# Altium project PCB_Pool.PrjPCB
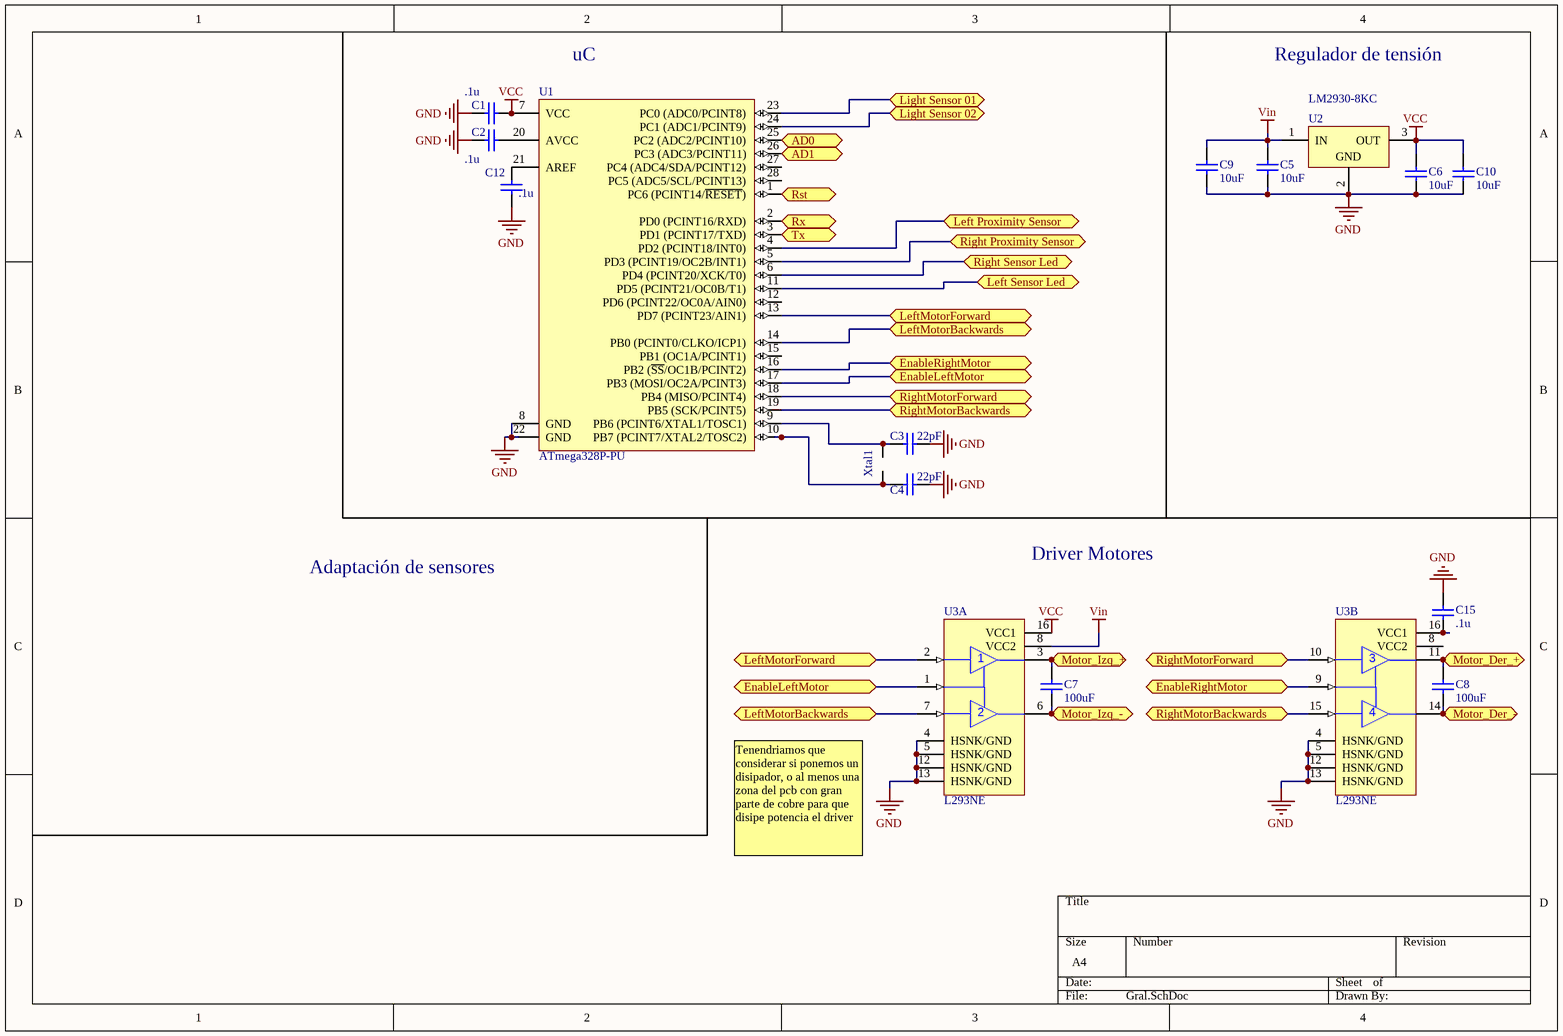
[diagram p0: Gral.SchDoc]
2 sheets, 41 parts. Net scope: flat (ports and power ports of the same name join across sheets).
Board file: Main.PcbDoc
Sheets:
  Gral.SchDoc
  Perifericos.SchDoc

## Sheet Gral.SchDoc
size A4

### Parts
C1  value .1u  [RAD-0.3]  (hidden comment: Cap)
C2  value .1u  [RAD-0.3]  (hidden comment: Cap)
C3  value 22pF  [RAD-0.3]  (hidden comment: Cap)
C4  value 22pF  [RAD-0.3]  (hidden comment: Cap)
C5  value 10uF  [RAD-0.3]  (hidden comment: Cap)
C6  value 10uF  [RAD-0.3]  (hidden comment: Cap)
C7  value 100uF  [RAD-0.3]  (hidden comment: Cap)
C8  value 100uF  [RAD-0.3]  (hidden comment: Cap)
C9  value 10uF  [RAD-0.3]  (hidden comment: Cap)
C10  value 10uF  [RAD-0.3]  (hidden comment: Cap)
C12  value .1u  [RAD-0.3]  (hidden comment: Cap)
C15  value .1u  [RAD-0.3]  (hidden comment: Cap)
U1  ATmega328P-PU  [28P3]
U2  LM2930-8KC  [KC03]
U3  L293NE  [NE016]  (parts A,B of 2)
Xtal1  Xtal  [Xtal]  (value not drawn)

### Ports
AD0, AD1, EnableLeftMotor, EnableRightMotor, Left Proximity Sensor, Left Sensor Led, LeftMotorBackwards, LeftMotorForward, Light Sensor 01, Light Sensor 02, Motor_Der_+, Motor_Der_-, Motor_Izq_+, Motor_Izq_-, Right Proximity Sensor, Right Sensor Led, RightMotorBackwards, RightMotorForward, Rst, Rx, Tx

### Nets
GND: C1.1 C2.1 C3.2 C4.2 C5.1 C6.1 C9.1 C10.1 C12.1 C15.1 U1.8(GND) U1.22(GND) U2.2(GND) U3.4(HSNK/GND) U3.5(HSNK/GND) U3.12(HSNK/GND) U3.13(HSNK/GND)
VCC: C1.2 C6.2 C10.2 U1.7(VCC) U2.3(OUT) U3.16(VCC1)
Vin: C5.2 C9.2 U2.1(IN) U3.8(VCC2)
NetC2_2: C2.2 U1.20(AVCC)
NetC3_1: C3.1 U1.9(PB6_(PCINT6/XTAL1/TOSC1)) Xtal1.2
NetC4_1: C4.1 U1.10(PB7_(PCINT7/XTAL2/TOSC2)) Xtal1.1
NetC7_1: C7.1 U3.6(2Y) ; port Motor_Izq_-
NetC7_2: C7.2 U3.3(1Y) ; port Motor_Izq_+
NetC8_1: C8.1 U3.14(4Y) ; port Motor_Der_-
NetC8_2: C8.2 U3.11(3Y) ; port Motor_Der_+
NetC11_1: U1.1(PC6_(PCINT14/~{RESET})) ; port Rst
NetC12_2: C12.2 U1.21(AREF)
NetC15_2: C15.2 U3.16(VCC1)
NetP8_2: U1.6(PD4_(PCINT20/XCK/T0)) ; port Right Sensor Led
NetP8_3: U1.4(PD2_(PCINT18/INT0)) ; port Left Proximity Sensor
NetP9_2: U1.11(PD5_(PCINT21/OC0B/T1)) ; port Left Sensor Led
NetP9_3: U1.5(PD3_(PCINT19/OC2B/INT1)) ; port Right Proximity Sensor
NetP12_1: U1.2(PD0_(PCINT16/RXD)) ; port Rx
NetP13_1: U1.3(PD1_(PCINT17/TXD)) ; port Tx
NetP15_1: U1.25(PC2_(ADC2/PCINT10)) ; port AD0
NetP15_2: U1.26(PC3_(ADC3/PCINT11)) ; port AD1
NetP16_1: U1.23(PC0_(ADC0/PCINT8)) ; port Light Sensor 01
NetP17_1: U1.24(PC1_(ADC1/PCINT9)) ; port Light Sensor 02
NetU1_13: U1.13(PD7_(PCINT23/AIN1)) U3.2(1A) ; port LeftMotorForward
NetU1_14: U1.14(PB0_(PCINT0/CLKO/ICP1)) U3.7(2A) ; port LeftMotorBackwards
NetU1_16: U1.16(PB2_(~{SS}/OC1B/PCINT2)) U3.9(3,4EN) ; port EnableRightMotor
NetU1_17: U1.17(PB3_(MOSI/OC2A/PCINT3)) U3.1(1,2EN) ; port EnableLeftMotor
NetU1_18: U1.18(PB4_(MISO/PCINT4)) U3.10(3A) ; port RightMotorForward
NetU1_19: U1.19(PB5_(SCK/PCINT5)) U3.15(4A) ; port RightMotorBackwards

Not connected (* = marked no-connect by the designer): U1 12(PD6_(PCINT22/OC0A/AIN0)) 15(PB1_(OC1A/PCINT1)) 27(PC4_(ADC4/SDA/PCINT12)) 28(PC5_(ADC5/SCL/PCINT13))

### Notes on the sheet
- (near U1) uC
- Regulador de tensión
- Adaptación de sensores
- Driver Motores
- Tenendriamos que considerar si ponemos un disipador, o al menos una zona del pcb con gran parte de cobre para que disipe potencia el driver

### Library data of the parts
C1-C10 C12 C15 = Cap: Capacitor; Published: 8-Jun-2000; LatestRevisionDate: 17-Jul-2002; LatestRevisionNote: Re-released for DXP Platform.; PackageReference: RAD-0.3; Publisher: Altium Limited; PackageDescription: Radial Cap, Thru-Hole; 2 Leads; 0.3 in Pin Spacing
U1 = ATmega328P-PU: 8-bit AVR Microcontroller, 32KB Flash, 1KB EEPROM, 2KB SRAM, 28-pin PDIP, Industrial Grade (-40°C to 85°C); Published: 1-Apr-2010; DatasheetVersion: revA, Jan-2010; PackageVersion: revB, Sep-2001; PackageReference: 28P3; Publisher: Altium Limited; PackageDescription: 28-lead (0.300"/7.62mm Wide) Plastic Dual Inline Package (PDIP); Supplier 1: Digi-Key; Supplier Part Number 1: ATMEGA328P-PU-ND; Supplier 2: Farnell; Supplier Part Number 2: 1715487; Supplier 3: Mouser; Supplier Part Number 3: 556-ATMEGA328P-PU; ComponentLink1Description: Manufacturer Link; ComponentLink1URL: http://www.atmel.com/products/avr/default.asp?; ComponentLink2Description: ATmega48A/48PA/88A/88PA/168A/168PA/328/328P Datasheet; ComponentLink2URL: http://www.atmel.com/dyn/resources/prod_documents/8271.pdf; ComponentLink3Description: ATmega48A/48PA/88A/88PA/168A/168PA/328/328P Summary; ComponentLink3URL: http://www.atmel.com/dyn/resources/prod_documents/8271S.pdf; ComponentLink4Description: Atmel.com Home; ComponentLink4URL: http://www.atmel.com
U2 = LM2930-8KC: 3-Terminal Positive Regulator; Note: Pin 2 is electrically connected to tab; Published: 15-Apr-2002; DatasheetVersion: Jun-1988; PackageVersion: Sep-1995; PackageReference: KC03; Publisher: Altium Limited; PackageDescription: TO, Thru-Hole, Vertical, Heatsink Mounted; 3 In-Line Leads; Pitch 2.54 mm; ComponentLink1Description: Manufacturer Link; ComponentLink1URL: http://www.ti.com/
U3 = L293NE: Quadruple Half-H Driver; Published: 15-May-2002; LatestRevisionDate: 29-May-2009; LatestRevisionNote: Component Body Added.; DatasheetVersion: May-1990; PackageVersion: 1991; PackageReference: NE016; Publisher: Altium Limited; PackageDescription: DIP, 16-Pin, Row Spacing 7.62 mm, Pitch 2.54 mm; Code_JEDEC: MS-001-BB; ComponentLink1Description: Manufacturer Link; ComponentLink1URL: http://www.ti.com/; ComponentLink2Description: Datasheet; ComponentLink2URL: http://www-s.ti.com/sc/ds/l293.pdf

## Sheet Perifericos.SchDoc
size A4
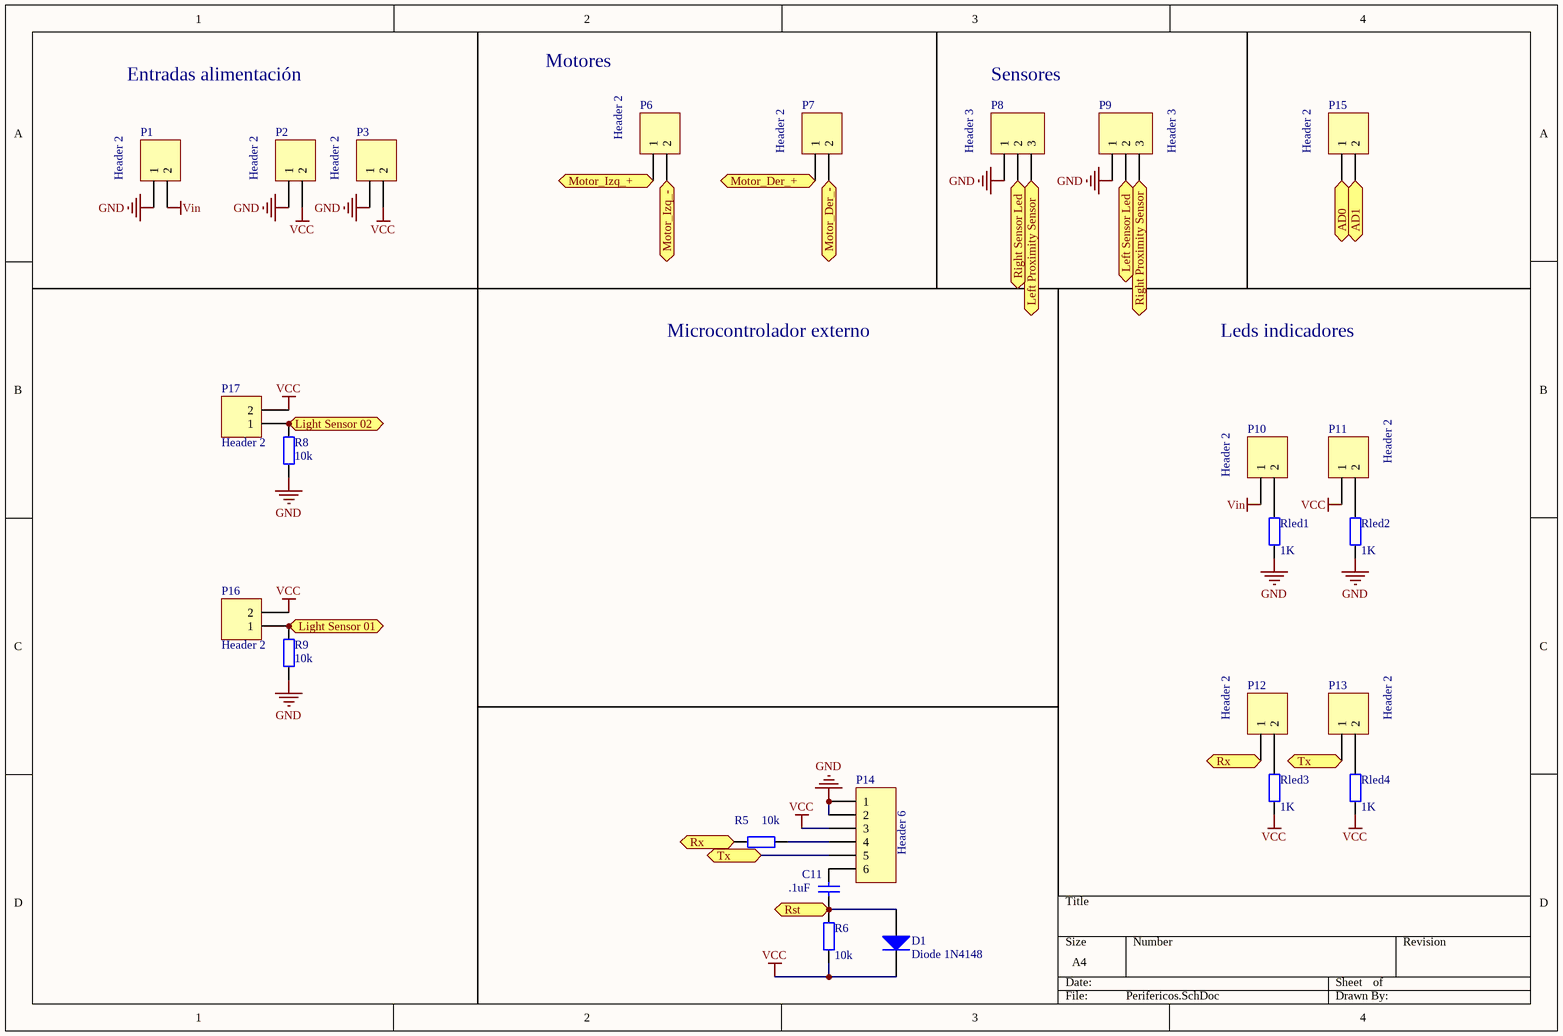
[diagram p1: Perifericos.SchDoc]

### Parts
C11  value .1uF  [RAD-0.3]  (hidden comment: Cap)
D1  Diode 1N4148  [DO-35]
P1  Header 2  [HDR1X2]
P2  Header 2  [HDR1X2]
P3  Header 2  [HDR1X2]
P6  Header 2  [HDR1X2]
P7  Header 2  [HDR1X2]
P8  Header 3  [HDR1X3]
P9  Header 3  [HDR1X3]
P10  Header 2  [HDR1X2]
P11  Header 2  [HDR1X2]
P12  Header 2  [HDR1X2]
P13  Header 2  [HDR1X2]
P14  Header 6  [HDR1X6]
P15  Header 2  [HDR1X2]
P16  Header 2  [HDR1X2]
P17  Header 2  [HDR1X2]
R5  value 10k  [AXIAL-0.4]  (hidden comment: Res2)
R6  value 10k  [AXIAL-0.4]  (hidden comment: Res2)
R8  value 10k  [AXIAL-0.4]  (hidden comment: Res2)
R9  value 10k  [AXIAL-0.4]  (hidden comment: Res2)
Rled1  value 1K  [AXIAL-0.4]  (hidden comment: Res2)
Rled2  value 1K  [AXIAL-0.4]  (hidden comment: Res2)
Rled3  value 1K  [AXIAL-0.4]  (hidden comment: Res2)
Rled4  value 1K  [AXIAL-0.4]  (hidden comment: Res2)

### Ports
AD0, AD1, Left Proximity Sensor, Left Sensor Led, Light Sensor 01, Light Sensor 02, Motor_Der_+, Motor_Der_-, Motor_Izq_+, Motor_Izq_-, Right Proximity Sensor, Right Sensor Led, Rst, Rx, Tx

### Nets
GND: P1.1 P2.1 P3.1 P8.1 P9.1 P14.1 P14.2 R8.1 R9.1 Rled1.1 Rled2.1
VCC: D1.2(K) P2.2 P3.2 P11.1 P14.3 P16.2 P17.2 R6.1 Rled3.1 Rled4.1
Vin: P1.2 P10.1
NetC7_1: P6.2 ; port Motor_Izq_-
NetC7_2: P6.1 ; port Motor_Izq_+
NetC8_1: P7.2 ; port Motor_Der_-
NetC8_2: P7.1 ; port Motor_Der_+
NetC11_1: C11.1 D1.1(A) R6.2 ; port Rst
NetC11_2: C11.2 P14.6
NetP8_2: P8.2 ; port Right Sensor Led
NetP8_3: P8.3 ; port Left Proximity Sensor
NetP9_2: P9.2 ; port Left Sensor Led
NetP9_3: P9.3 ; port Right Proximity Sensor
NetP10_2: P10.2 Rled1.2
NetP11_2: P11.2 Rled2.2
NetP12_1: P12.1 R5.1 ; port Rx
NetP12_2: P12.2 Rled3.2
NetP13_1: P13.1 P14.5 ; port Tx
NetP13_2: P13.2 Rled4.2
NetP14_4: P14.4 R5.2
NetP15_1: P15.1 ; port AD0
NetP15_2: P15.2 ; port AD1
NetP16_1: P16.1 R9.2 ; port Light Sensor 01
NetP17_1: P17.1 R8.2 ; port Light Sensor 02

### Notes on the sheet
- Entradas alimentación
- Motores
- Sensores
- Microcontrolador externo
- Leds indicadores

### Library data of the parts
C11 = Cap: Capacitor; Published: 8-Jun-2000; LatestRevisionDate: 17-Jul-2002; LatestRevisionNote: Re-released for DXP Platform.; PackageReference: RAD-0.3; Publisher: Altium Limited; PackageDescription: Radial Cap, Thru-Hole; 2 Leads; 0.3 in Pin Spacing
D1 = Diode 1N4148: High Conductance Fast Diode; Published: 8-Jun-2000; LatestRevisionDate: 17-Jul-2002; LatestRevisionNote: Re-released for DXP Platform.; DatasheetVersion: 1997; PackageReference: DO-35; Publisher: Altium Limited; PackageDescription: Diode, Axial; Body 3.8 x 1.9 mm (LxDia. max), Lead Dia. 0.53 mm (max); Code_JEDEC: DO-204-AH; ComponentLink1Description: Manufacturer Link; ComponentLink1URL: http://www.fairchildsemi.com/; ComponentLink2Description: Datasheet; ComponentLink2URL: http://www.fairchildsemi.com/ds/1N%2F1N4148.pdf
P1-P3 P6 P7 P10-P13 P15-P17 = Header 2: Header, 2-Pin; LatestRevisionDate: 17-Jul-2002; LatestRevisionNote: Re-released for DXP Platform.; Publisher: Altium Limited
P8 P9 = Header 3: Header, 3-Pin; LatestRevisionDate: 17-Jul-2002; LatestRevisionNote: Re-released for DXP Platform.; Publisher: Altium Limited
P14 = Header 6: Header, 6-Pin; LatestRevisionDate: 17-Jul-2002; LatestRevisionNote: Re-released for DXP Platform.; Publisher: Altium Limited
R5 R6 R8 R9 Rled1-Rled4 = Res2: Resistor; Published: 8-Jun-2000; LatestRevisionDate: 17-Jul-2002; LatestRevisionNote: Re-released for DXP Platform.; PackageReference: AXIAL-0.4; Publisher: Altium Limited; PackageDescription: Axial Device, Thru-Hole; 2 Leads; 0.4 in Pin Spacing

## Nets that join several sheets
GND: Gral (17 pins), Perifericos (11 pins)
VCC: Gral (6 pins), Perifericos (10 pins)
Vin: Gral (C5.2 C9.2 U2.1 U3.8), Perifericos (P1.2 P10.1)
NetC7_1: Gral (C7.1 U3.6), Perifericos (P6.2)
NetC7_2: Gral (C7.2 U3.3), Perifericos (P6.1)
NetC8_1: Gral (C8.1 U3.14), Perifericos (P7.2)
NetC8_2: Gral (C8.2 U3.11), Perifericos (P7.1)
NetC11_1: Gral (U1.1), Perifericos (C11.1 D1.1 R6.2)
NetP8_2: Gral (U1.6), Perifericos (P8.2)
NetP8_3: Gral (U1.4), Perifericos (P8.3)
NetP9_2: Gral (U1.11), Perifericos (P9.2)
NetP9_3: Gral (U1.5), Perifericos (P9.3)
NetP12_1: Gral (U1.2), Perifericos (P12.1 R5.1)
NetP13_1: Gral (U1.3), Perifericos (P13.1 P14.5)
NetP15_1: Gral (U1.25), Perifericos (P15.1)
NetP15_2: Gral (U1.26), Perifericos (P15.2)
NetP16_1: Gral (U1.23), Perifericos (P16.1 R9.2)
NetP17_1: Gral (U1.24), Perifericos (P17.1 R8.2)